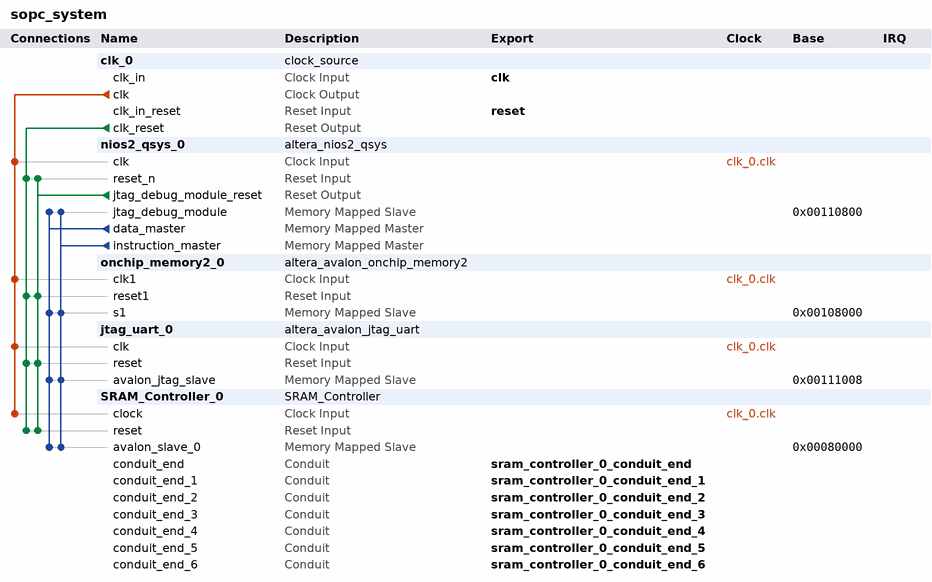
[diagram p0: system contents]
# Platform Designer (Qsys) system sopc_system, Cyclone II EP2C35F672C6
# Parameters at their usual value, and those the tool derives, are not listed.
package require -exact qsys 13.0
create_system sopc_system
set_project_property DEVICE_FAMILY {Cyclone II}
set_project_property DEVICE EP2C35F672C6

add_instance clk_0 clock_source 13.0
set_instance_parameter_value clk_0 clockFrequency 50000000

add_instance nios2_qsys_0 altera_nios2_qsys 13.0
set_instance_parameter_value nios2_qsys_0 resetSlave onchip_memory2_0.s1
set_instance_parameter_value nios2_qsys_0 mmu_TLBMissExcSlave None
set_instance_parameter_value nios2_qsys_0 exceptionSlave onchip_memory2_0.s1
set_instance_parameter_value nios2_qsys_0 breakSlave nios2_qsys_0.jtag_debug_module
set_instance_parameter_value nios2_qsys_0 impl Fast
set_instance_parameter_value nios2_qsys_0 icache_size 4096

add_instance onchip_memory2_0 altera_avalon_onchip_memory2 13.0.1.99.2
set_instance_parameter_value onchip_memory2_0 dataWidth 32
set_instance_parameter_value onchip_memory2_0 dualPort false
set_instance_parameter_value onchip_memory2_0 initMemContent true
set_instance_parameter_value onchip_memory2_0 initializationFileName onchip_mem.hex
set_instance_parameter_value onchip_memory2_0 memorySize 32768

add_instance jtag_uart_0 altera_avalon_jtag_uart 13.0.1.99.2
set_instance_parameter_value jtag_uart_0 simInteractiveOptions NO_INTERACTIVE_WINDOWS

add_instance SRAM_Controller_0 SRAM_Controller 1.0

# connections
add_connection clk_0.clk jtag_uart_0.clk clock
add_connection clk_0.clk nios2_qsys_0.clk clock
add_connection clk_0.clk onchip_memory2_0.clk1 clock
add_connection clk_0.clk SRAM_Controller_0.clock clock
add_connection clk_0.clk_reset jtag_uart_0.reset reset
add_connection clk_0.clk_reset nios2_qsys_0.reset_n reset
add_connection clk_0.clk_reset onchip_memory2_0.reset1 reset
add_connection clk_0.clk_reset SRAM_Controller_0.reset reset
add_connection nios2_qsys_0.jtag_debug_module_reset jtag_uart_0.reset reset
add_connection nios2_qsys_0.jtag_debug_module_reset nios2_qsys_0.reset_n reset
add_connection nios2_qsys_0.jtag_debug_module_reset onchip_memory2_0.reset1 reset
add_connection nios2_qsys_0.jtag_debug_module_reset SRAM_Controller_0.reset reset
add_connection nios2_qsys_0.data_master jtag_uart_0.avalon_jtag_slave avalon
set_connection_parameter_value nios2_qsys_0.data_master/jtag_uart_0.avalon_jtag_slave baseAddress 0x00111008
add_connection nios2_qsys_0.data_master nios2_qsys_0.jtag_debug_module avalon
set_connection_parameter_value nios2_qsys_0.data_master/nios2_qsys_0.jtag_debug_module baseAddress 0x00110800
add_connection nios2_qsys_0.data_master onchip_memory2_0.s1 avalon
set_connection_parameter_value nios2_qsys_0.data_master/onchip_memory2_0.s1 baseAddress 0x00108000
add_connection nios2_qsys_0.data_master SRAM_Controller_0.avalon_slave_0 avalon
set_connection_parameter_value nios2_qsys_0.data_master/SRAM_Controller_0.avalon_slave_0 baseAddress 0x00080000
add_connection nios2_qsys_0.instruction_master jtag_uart_0.avalon_jtag_slave avalon
set_connection_parameter_value nios2_qsys_0.instruction_master/jtag_uart_0.avalon_jtag_slave baseAddress 0x00111008
add_connection nios2_qsys_0.instruction_master nios2_qsys_0.jtag_debug_module avalon
set_connection_parameter_value nios2_qsys_0.instruction_master/nios2_qsys_0.jtag_debug_module baseAddress 0x00110800
add_connection nios2_qsys_0.instruction_master onchip_memory2_0.s1 avalon
set_connection_parameter_value nios2_qsys_0.instruction_master/onchip_memory2_0.s1 baseAddress 0x00108000
add_connection nios2_qsys_0.instruction_master SRAM_Controller_0.avalon_slave_0 avalon
set_connection_parameter_value nios2_qsys_0.instruction_master/SRAM_Controller_0.avalon_slave_0 baseAddress 0x00080000

# exported interfaces
add_interface clk clock sink
set_interface_property clk EXPORT_OF clk_0.clk_in
add_interface reset reset sink
set_interface_property reset EXPORT_OF clk_0.clk_in_reset
add_interface sram_controller_0_conduit_end conduit end
set_interface_property sram_controller_0_conduit_end EXPORT_OF SRAM_Controller_0.conduit_end
add_interface sram_controller_0_conduit_end_1 conduit end
set_interface_property sram_controller_0_conduit_end_1 EXPORT_OF SRAM_Controller_0.conduit_end_1
add_interface sram_controller_0_conduit_end_2 conduit end
set_interface_property sram_controller_0_conduit_end_2 EXPORT_OF SRAM_Controller_0.conduit_end_2
add_interface sram_controller_0_conduit_end_3 conduit end
set_interface_property sram_controller_0_conduit_end_3 EXPORT_OF SRAM_Controller_0.conduit_end_3
add_interface sram_controller_0_conduit_end_4 conduit end
set_interface_property sram_controller_0_conduit_end_4 EXPORT_OF SRAM_Controller_0.conduit_end_4
add_interface sram_controller_0_conduit_end_5 conduit end
set_interface_property sram_controller_0_conduit_end_5 EXPORT_OF SRAM_Controller_0.conduit_end_5
add_interface sram_controller_0_conduit_end_6 conduit end
set_interface_property sram_controller_0_conduit_end_6 EXPORT_OF SRAM_Controller_0.conduit_end_6

set_interconnect_requirement {$system} qsys_mm.clockCrossingAdapter HANDSHAKE
set_interconnect_requirement {$system} qsys_mm.maxAdditionalLatency 1

save_system sopc_system.qsys
